# EAGLE design 16-bit-OV7670 mini Camera wing (EAGLE 6.6.0)
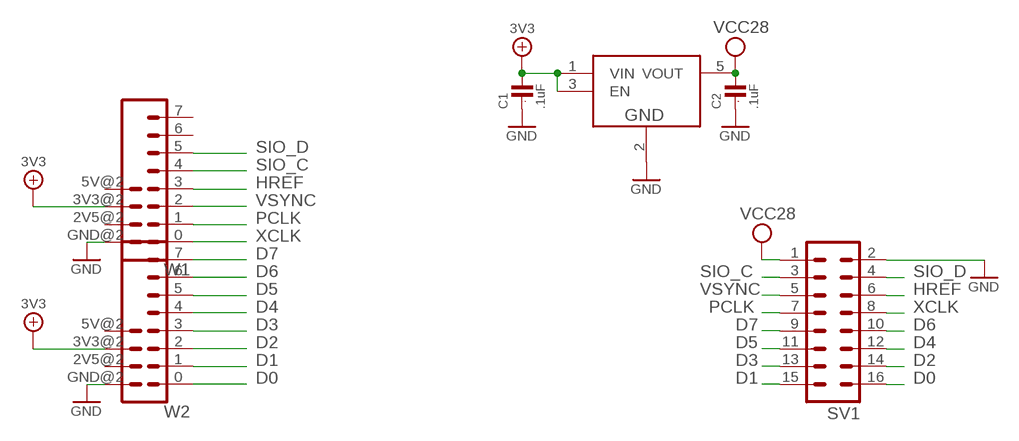
[diagram p0: schematic, sheet 1]

## Parts
C1  .1uF  C0603  [0603]
C2  .1uF  C0603  [0603]
SV1  ML16  [ML16]
U1  TPS73028  LP3990MF  [SOT23-DBV]
W1  WING8WING8_NOHOLES  [WINGSIDE_8BIT_NOHOLES]
W2  WING8WING8_NOHOLES  [WINGSIDE_8BIT_NOHOLES]

## Nets
3V3: C1.2 U1.1(VIN) U1.3(EN) W1.3V3@2(3V3) W2.3V3@2(3V3)
D0: SV1.16 W2.0
D1: SV1.15 W2.1
D2: SV1.14 W2.2
D3: SV1.13 W2.3
D4: SV1.12 W2.4
D5: SV1.11 W2.5
D6: SV1.10 W2.6
D7: SV1.9 W2.7
GND: C1.1 C2.1 SV1.2 U1.2(GND) W1.GND@2(GND) W2.GND@2(GND)
HREF: SV1.6 W1.3
PCLK: SV1.7 W1.1
SIO_C: SV1.3 W1.4
SIO_D: SV1.4 W1.5
VCC28: C2.2 SV1.1 U1.5(VOUT)
VSYNC: SV1.5 W1.2
XCLK: SV1.8 W1.0
Unconnected: U1.4(NC) W1.2V5@2(2V5) W1.5V@2(5V) W1.6 W1.7 W2.2V5@2(2V5) W2.5V@2(5V)

## Library data of the parts
C1 C2 = GadgetFactory_all:C: CAPACITOR, European symbol; PARTNO: GRM188F51E104ZA01D
SV1 = con-ml:ML16: HARTING; PARTNO: PRPC004DAAN-RC
U1 = spiadc:LP3990; PARTNO: TPS73028DBVT
W1 W2 = Papilio:WING8; PARTNO: 68001-112HLF

## Board
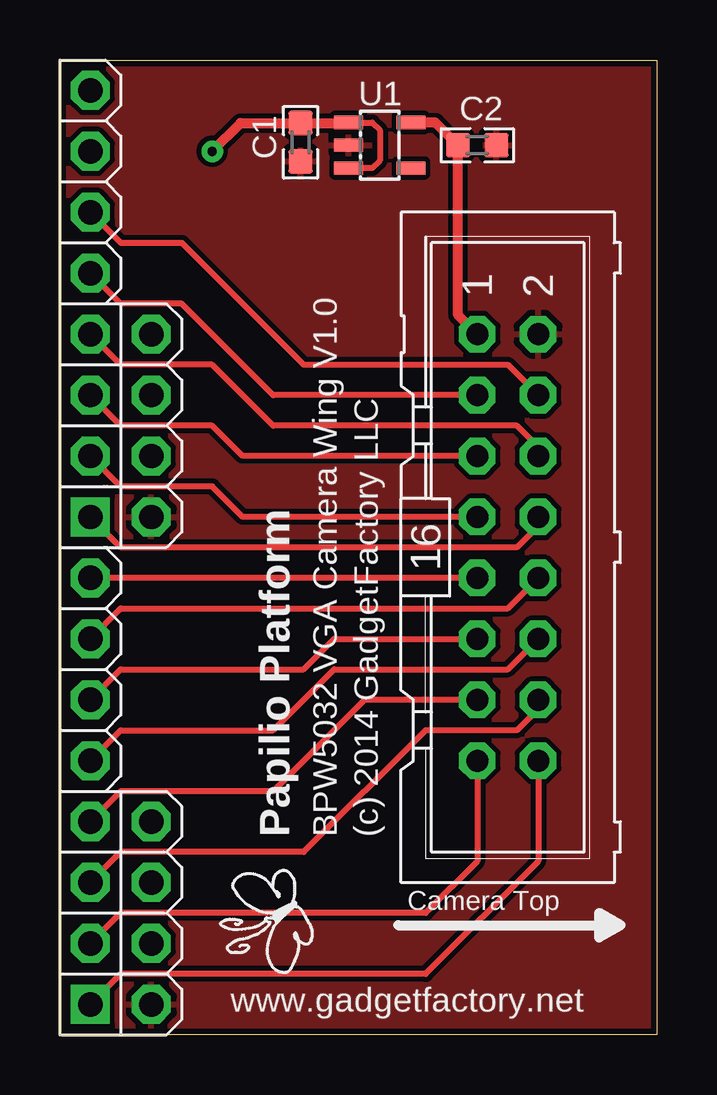
[diagram p1: board, top side]
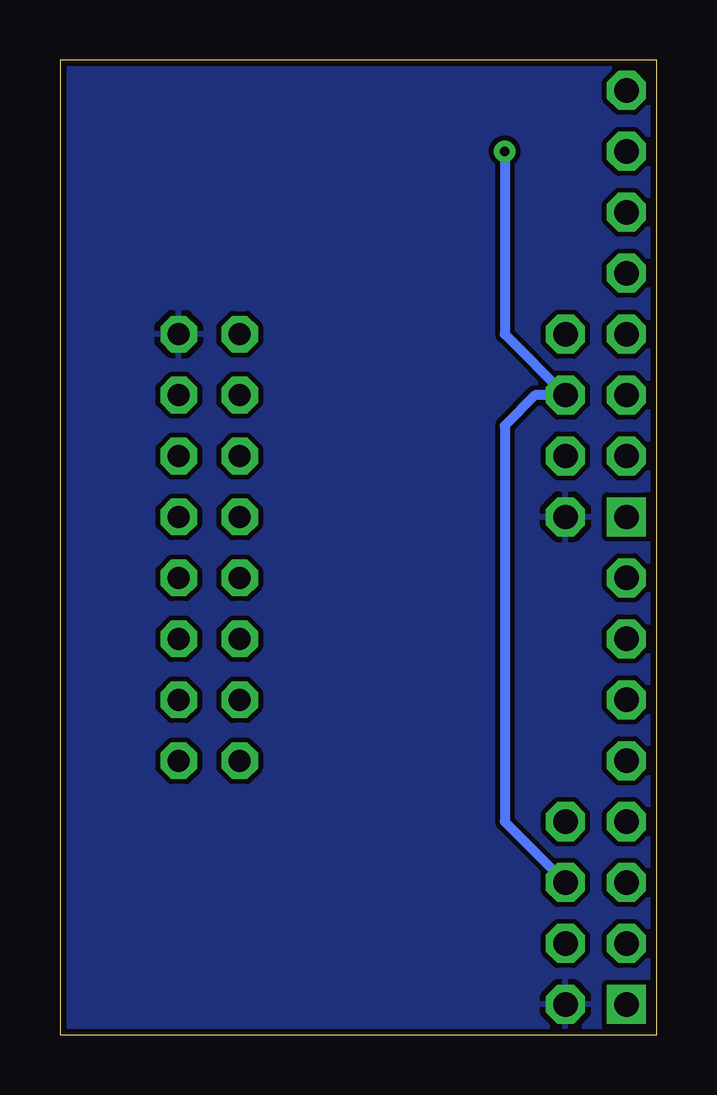
[diagram p2: board, bottom side, seen from below]

Size 24.89 x 40.64 mm. Coordinates in mm from the lower left corner, seen from the top.
Outline: 0,0 0,40.64 24.89,40.64 24.89,0 0,0
Copper layers (1*16): Top 0.035mm / dielectric 1.5mm / Bottom 0.035mm
Design rules "SparkFun_Derived_GoldePheonix_10mil": minimum track width 10mil, minimum drill 15mil, track to track 8mil, track to pad 8mil, pad to pad 8mil, via to via 8mil, smd to smd 8mil, copper to edge 10mil, drill to drill 8mil, minimum pad ring 12mil, minimum via ring 10mil, stop-mask expansion 4mil, vias tented up to drill 18mil, thermal gap 10mil

### Footprints (pad centres in the part's own frame; a part is rotated, then mirrored left to right if it is on the bottom)
0603 = smd 1 x 1: 1 -0.8,0; 2 0.8,0
ML16 = drill 0.914 octagon: 1 -8.89,-1.27; 2 -8.89,1.27; 3 -6.35,-1.27; 4 -6.35,1.27; 5 -3.81,-1.27; 6 -3.81,1.27; 7 -1.27,-1.27; 8 -1.27,1.27; 9 1.27,-1.27; 10 1.27,1.27; 11 3.81,-1.27; 12 3.81,1.27; 13 6.35,-1.27; 14 6.35,1.27; 15 8.89,-1.27; 16 8.89,1.27
SOT23-DBV = smd 0.55 x 1.2: 1 -0.95,-1.3; 2 0,-1.3; 3 0.95,-1.3; 4 0.95,1.3; 5 -0.95,1.3
WINGSIDE_8BIT_NOHOLES = drill 1.016 square: 0 19.05,1.27 | drill 1.016 octagon: 1 16.51,1.27; 2 13.97,1.27; 2V5@2 16.51,3.81; 3 11.43,1.27; 3V3@2 13.97,3.81; 4 8.89,1.27; 5 6.35,1.27; 5V@2 11.43,3.81; 6 3.81,1.27; 7 1.27,1.27; GND@2 19.05,3.81

### Placement (x,y rotation side)
C1  10.03,37.21 90 top
C2  17.4,37.08 180 top
SV1  18.67,20.32 270 top
U1  13.34,37.08 270 top
U$1  [BUTTERFLY_LOGO]  9.14,4.83 90 top
W1  0,40.64 270 top
W2  0,20.32 270 top

### Tracks (layer width: path | path; a pad name or v marks a point on that pad's centre or on a via)
3V3  (via drill 0.38)
  Top 0.254: U1.1 13.02,38.03 13.34,37.72 13.34,36.45 13.02,36.13 U1.3
  Top 0.406: U1.1 12.01,38.01 C1.2 7.53,38.01 v6.35,36.83
  Bottom 0.406: v6.35,36.83 6.35,29.21 W1.3V3@2 5.08,26.67 6.35,25.4 6.35,8.89 W2.3V3@2
D0
  Top 0.254: SV1.16 19.94,7.24 15.24,2.54 2.54,2.54 W2.0
D1
  Top 0.254: SV1.15 17.4,7.24 15.24,5.08 2.54,5.08 W2.1
D2
  Top 0.254: SV1.14 19.94,13.59 19.05,12.7 15.24,12.7 10.16,7.62 2.54,7.62 W2.2
D3
  Top 0.254: SV1.13 12.7,13.97 8.89,10.16 2.54,10.16 W2.3
D4
  Top 0.254: W2.4 2.54,12.7 8.89,12.7 11.43,15.24 18.67,15.24 SV1.12
D5
  Top 0.254: W2.5 2.54,15.24 10.16,15.24 11.43,16.51 SV1.11
D6
  Top 0.254: W2.6 2.54,17.78 18.67,17.78 SV1.10
D7
  Top 0.254: SV1.9 W2.7
GND
  pour Top: 0,0 0,40.64 24.89,40.64 24.89,0
  pour Bottom: 0,0 0,40.64 24.89,40.64 24.89,0
HREF
  Top 0.254: SV1.6 19.94,24.51 19.05,25.4 8.89,25.4 6.35,27.94 2.54,27.94 W1.3
PCLK
  Top 0.254: SV1.7 7.62,21.59 6.35,22.86 2.54,22.86 W1.1
SIO_C
  Top 0.254: SV1.3 8.89,26.67 5.08,30.48 2.54,30.48 W1.4
SIO_D
  Top 0.254: W1.5 2.54,33.02 5.08,33.02 10.16,27.94 18.67,27.94 SV1.4
VCC28
  Top 0.406: U1.5 15.65,38.03 C2.2 16.6,30.01 SV1.1
VSYNC
  Top 0.254: SV1.5 7.62,24.13 6.35,25.4 2.54,25.4 W1.2
XCLK
  Top 0.254: SV1.8 19.94,21.21 19.05,20.32 2.54,20.32 W1.0

### Text on the board
tPlace: Papilio Platform | BPW5032 VGA Camera Wing V1.0 | (c) 2014 GadgetFactory LLC | Camera Top | www.gadgetfactory.net